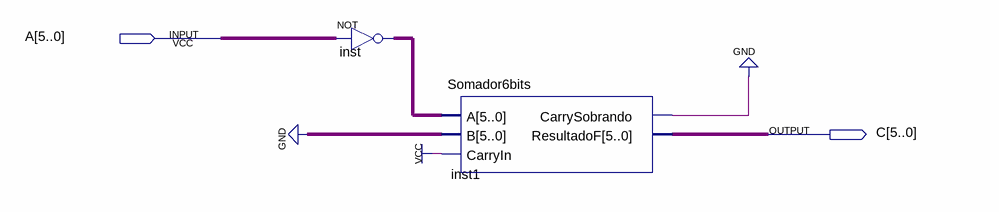
[diagram p0: schematic sheet]
// Quartus schematic cmpA2_6bits.bdf as structural Verilog: 2 symbols, 2 pins
module cmpA2_6bits (
  input  [5:0] A,
  output [5:0] C
);

  wire inst1_carrysobrando;
  wire [5:0] inst_out;

  assign inst_out = ~A;  // NOT inst, 6 bits wide
  Somador6bits inst1 (.A(inst_out), .B({6{1'b0}}), .CarryIn(1'b1), .CarrySobrando(inst1_carrysobrando), .ResultadoF(C));
  // also tied to GND on the sheet: inst1_carrysobrando
endmodule
